# EAGLE design 3pdt (EAGLE 7.5.0)
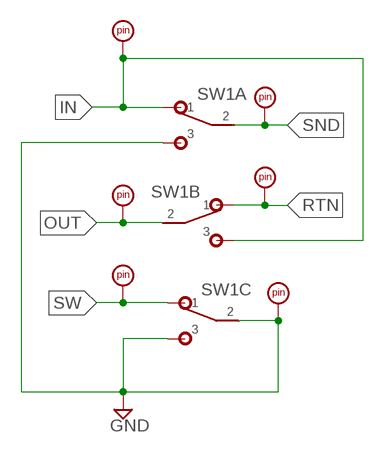
[diagram p0: schematic, sheet 1]

## Parts
GND  PADRND  [ROUND]
IN  PADSQR  [SQUARE]
OUT  PADSQR  [SQUARE]
RTN  PADSQR  [SQUARE]
SND  PADSQR  [SQUARE]
SW  PADRND  [ROUND]
SW1  3PDT  [3PDT]

## Nets
GND: GND.1 SW1.A3 SW1.C2 SW1.C3
IN: IN.1 SW1.A1 SW1.B3
OUT: OUT.1 SW1.B2
RTN: RTN.1 SW1.B1
SND: SND.1 SW1.A2
SW: SW1.C1 SW.1

## Library data of the parts
GND IN OUT RTN SND SW = supply pins:PAD
SW1 = switches:3PDT

## Board
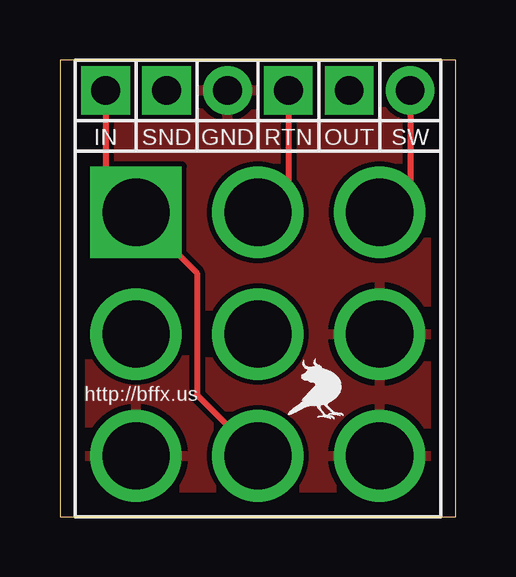
[diagram p1: board, top side]
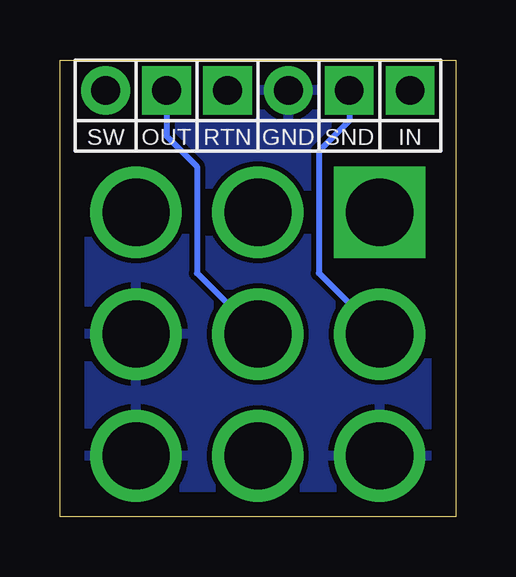
[diagram p2: board, bottom side, seen from below]

Size 16.51 x 19.05 mm. Coordinates in mm from the lower left corner, seen from the top.
Outline: 0,0 16.51,0 16.51,19.05 0,19.05 0,0
Copper layers (1*16): Top 0.035mm / dielectric 1.5mm / Bottom 0.035mm
Design rules "default": minimum track width 10mil, minimum drill 24mil, track to track 8mil, track to pad 8mil, pad to pad 8mil, via to via 8mil, smd to smd 8mil, copper to edge 40mil, drill to drill 8mil, minimum pad ring 10mil, minimum via ring 8mil, stop-mask expansion 4mil, vias tented up to drill 0mil, thermal gap 10mil

### Footprints (pad centres in the part's own frame; a part is rotated, then mirrored left to right if it is on the bottom)
ROUND = drill 1.2 pad 2.032: 1 0,0
SQUARE = drill 1.2 pad 2.032 square: 1 0,0
3PDT = drill 2.8 square: A1 -5.08,5.08 | drill 2.8: A2 -5.08,0; A3 -5.08,-5.08; B1 0,5.08; B2 0,0; B3 0,-5.08; C1 5.08,5.08; C2 5.08,0; C3 5.08,-5.08

### Placement (x,y rotation side)
GND  6.99,17.78 0 top
IN  1.91,17.78 0 top
OUT  12.06,17.78 0 top
RTN  9.53,17.78 0 top
SND  4.45,17.78 0 top
SW  14.61,17.78 0 top
SW1  8.26,7.62 0 top
U$1  [BF0100]  10.67,5.33 0 top

### Tracks (layer width: path | path; a pad name or v marks a point on that pad's centre or on a via)
GND
  pour Bottom: 0.64,19.05 15.88,19.05 15.88,0 0.64,0
  pour Top: 0.64,19.05 15.88,19.05 15.88,0 0.64,0
IN
  Top 0.254: IN.1 1.91,13.97 SW1.A1 5.71,10.16 5.71,5.08 SW1.B3
OUT
  Bottom 0.254: OUT.1 12.06,15.88 10.79,14.61 10.79,10.16 SW1.B2
RTN
  Top 0.254: RTN.1 9.53,13.97 SW1.B1
SND
  Bottom 0.254: SND.1 4.45,16.51 5.71,15.24 5.71,10.16 SW1.A2
SW
  Top 0.254: SW.1 14.61,13.97 SW1.C1

### Text on the board
tPlace: http://bffx.us